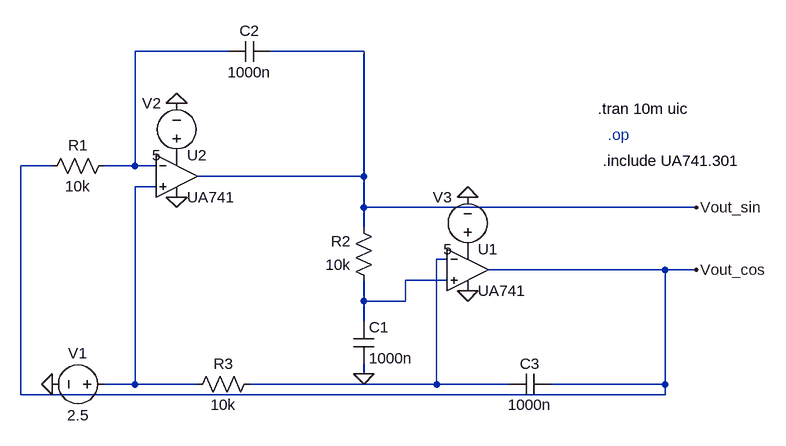
[diagram p0: schematic dcsine1.asc]
dcsine1.asc, the LTspice schematic file:
Version 4
SHEET 1 1092 680
WIRE 256 96 112 96
WIRE 464 96 320 96
WIRE -16 272 -64 272
WIRE 112 272 112 96
WIRE 112 272 64 272
WIRE 144 272 112 272
WIRE 464 288 464 96
WIRE 464 288 208 288
WIRE 144 304 112 304
WIRE 464 336 464 288
WIRE 976 336 464 336
WIRE 464 368 464 336
WIRE 592 416 576 416
WIRE 928 432 656 432
WIRE 976 432 928 432
WIRE 592 448 528 448
WIRE 464 480 464 448
WIRE 528 480 528 448
WIRE 528 480 464 480
WIRE 464 512 464 480
WIRE 464 592 464 576
WIRE 112 608 112 304
WIRE 112 608 64 608
WIRE 208 608 112 608
WIRE 576 608 576 416
WIRE 576 608 288 608
WIRE 688 608 576 608
WIRE 928 608 928 432
WIRE 928 608 752 608
WIRE -64 624 -64 272
WIRE 928 624 928 608
WIRE 928 624 -64 624
FLAG 464 592 0
FLAG 976 432 Vout_cos
FLAG 976 336 Vout_sin
FLAG -16 608 0
FLAG 176 176 0
FLAG 176 320 0
FLAG 624 464 0
FLAG 624 320 0
SYMBOL res 80 256 R90
WINDOW 0 0 56 VBottom 2
WINDOW 3 32 56 VTop 2
SYMATTR InstName R1
SYMATTR Value 10k
SYMBOL res 480 464 R180
WINDOW 0 36 76 Left 2
WINDOW 3 36 40 Left 2
SYMATTR InstName R2
SYMATTR Value 10k
SYMBOL cap 448 512 R0
SYMATTR InstName C1
SYMATTR Value 1000n
SYMBOL cap 320 80 R90
WINDOW 0 0 32 VBottom 2
WINDOW 3 32 32 VTop 2
SYMATTR InstName C2
SYMATTR Value 1000n
SYMBOL res 304 592 R90
WINDOW 0 0 56 VBottom 2
WINDOW 3 32 56 VTop 2
SYMATTR InstName R3
SYMATTR Value 10k
SYMBOL voltage 80 608 R90
WINDOW 0 -32 56 VBottom 2
WINDOW 3 32 56 VTop 2
SYMATTR InstName V1
SYMATTR Value 2.5
SYMBOL cap 752 592 R90
WINDOW 0 0 32 VBottom 2
WINDOW 3 32 32 VTop 2
SYMATTR InstName C3
SYMATTR Value 1000n
SYMBOL voltage 176 272 R180
WINDOW 0 24 96 Left 2
WINDOW 3 24 16 Left 2
SYMATTR InstName V2
SYMATTR Value 5
SYMBOL voltage 624 416 R180
WINDOW 0 24 96 Left 2
WINDOW 3 24 16 Left 2
SYMATTR InstName V3
SYMATTR Value 5
SYMBOL OpAmps/opamp2 624 368 R0
SYMATTR InstName U1
SYMATTR Value UA741
SYMBOL OpAmps/opamp2 176 224 R0
SYMATTR InstName U2
SYMATTR Value UA741
TEXT 824 184 Left 2 !.tran 10m uic
TEXT 840 224 Left 2 ;.op
TEXT 832 264 Left 2 !.include UA741.301

The netlist it stands for:
* dcsine1.asc
R1 N001 Vout_cos 10k
R2 N004 Vout_sin 10k
C1 N004 0 1000n
C2 Vout_sin N001 1000n
R3 N003 N002 10k
V1 N002 0 2.5
C3 Vout_cos N003 1000n
V2 P001 0 5
V3 P002 0 5
XU1 N004 N003 P002 0 Vout_cos UA741  ; pins In+ In- V+ V- OUT
XU2 N002 N001 P001 0 Vout_sin UA741  ; pins In+ In- V+ V- OUT
.tran 10m uic
* .op
.include UA741.301
.backanno
.end